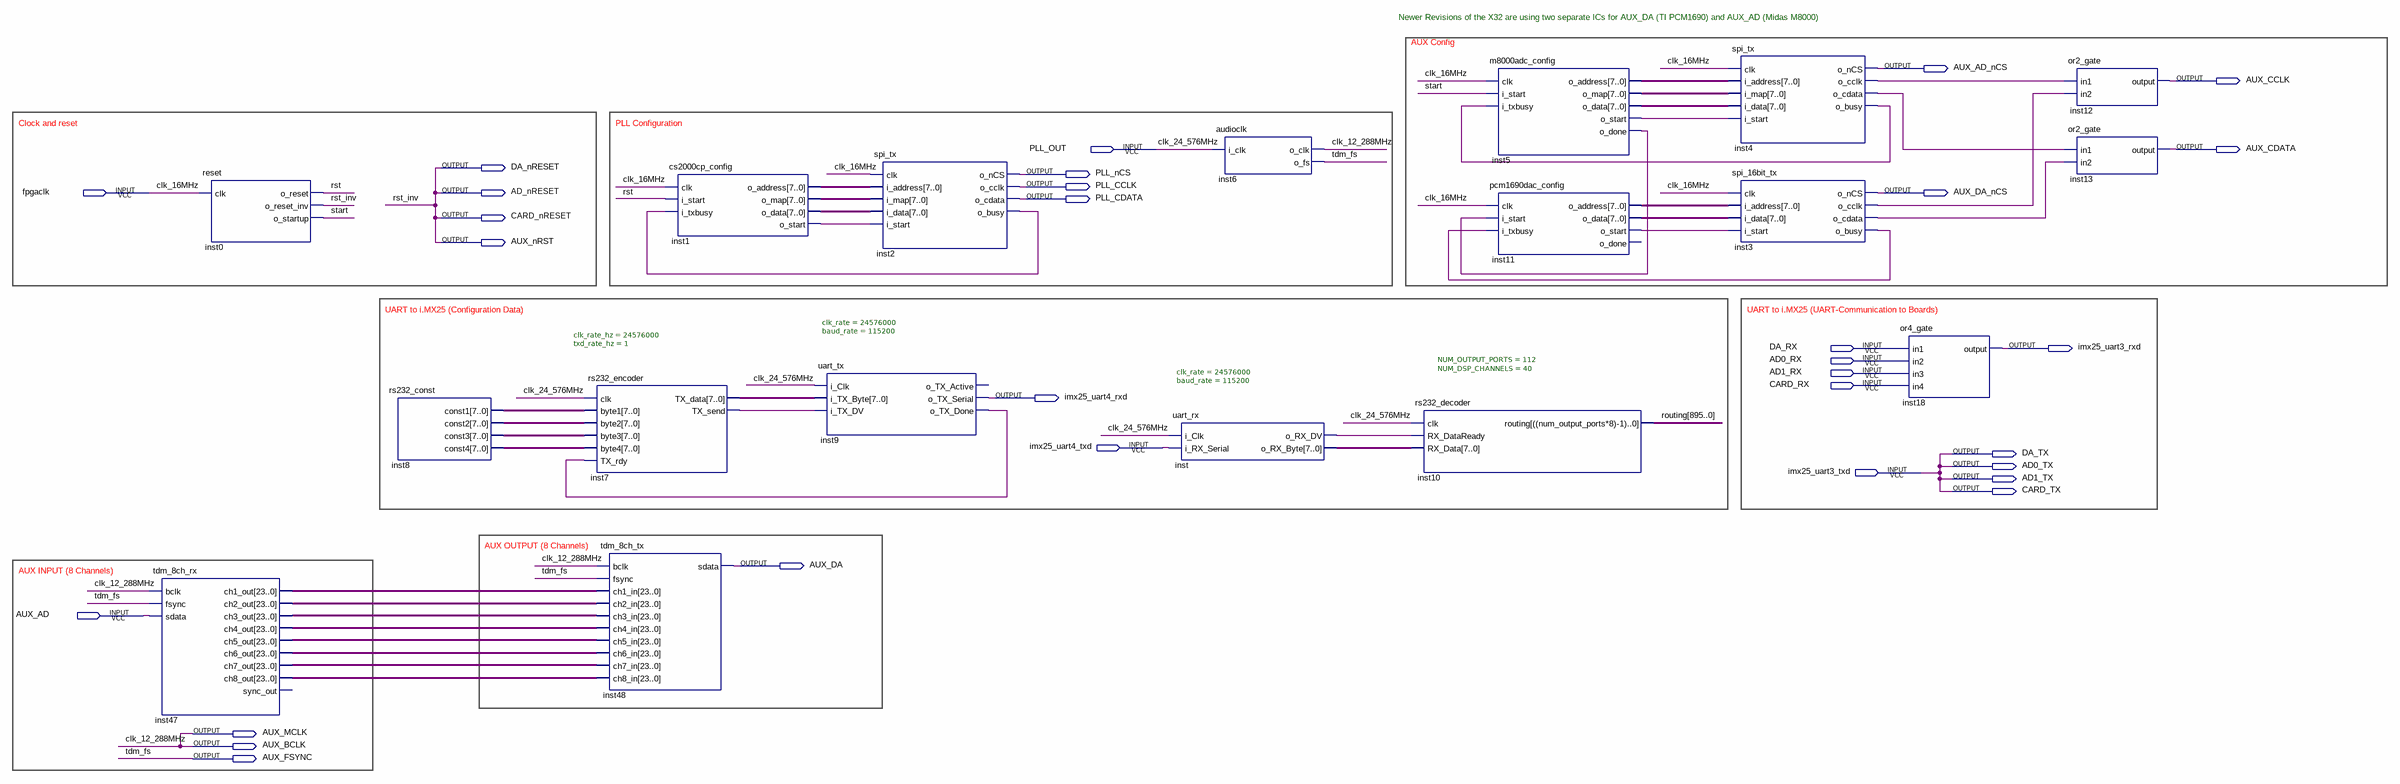
[diagram p0: schematic sheet]
// Quartus schematic main_minimaltest.bdf as structural Verilog: 18 symbols, 30 pins
module main_minimaltest (
  input  PLL_OUT,
  input  fpgaclk,
  input  DA_RX,
  input  AD0_RX,
  input  AD1_RX,
  input  CARD_RX,
  input  imx25_uart4_txd,
  input  imx25_uart3_txd,
  input  AUX_AD,
  output AUX_AD_nCS,
  output AUX_CCLK,
  output AUX_CDATA,
  output DA_nRESET,
  output PLL_nCS,
  output PLL_CCLK,
  output AD_nRESET,
  output AUX_DA_nCS,
  output PLL_CDATA,
  output CARD_nRESET,
  output AUX_nRST,
  output imx25_uart3_rxd,
  output imx25_uart4_rxd,
  output DA_TX,
  output AD0_TX,
  output AD1_TX,
  output CARD_TX,
  output AUX_DA,
  output AUX_MCLK,
  output AUX_BCLK,
  output AUX_FSYNC
);

  wire inst1_o_start, inst2_o_busy, inst3_o_busy, inst3_o_cclk, inst3_o_cdata, inst4_o_busy, inst4_o_cclk,
       inst4_o_cdata, inst5_o_done, inst5_o_start, inst7_tx_send, inst9_o_tx_done, inst11_o_start,
       inst_o_rx_dv, rst, start;
  wire [7:0] inst1_o_address, inst1_o_data, inst1_o_map, inst5_o_address, inst5_o_data, inst5_o_map,
       inst7_tx_data, inst8_const1, inst8_const2, inst8_const3, inst8_const4, inst11_o_address,
       inst11_o_data, inst_o_rx_byte;
  wire [23:0] inst47_ch1_out, inst47_ch2_out, inst47_ch3_out, inst47_ch4_out, inst47_ch5_out, inst47_ch6_out,
       inst47_ch7_out, inst47_ch8_out;
  wire [895:0] routing;

  tdm_8ch_rx inst47 (
    .bclk(AUX_BCLK), .fsync(AUX_FSYNC), .sdata(AUX_AD), .ch1_out(inst47_ch1_out), .ch2_out(inst47_ch2_out),
    .ch3_out(inst47_ch3_out), .ch4_out(inst47_ch4_out), .ch5_out(inst47_ch5_out), .ch6_out(inst47_ch6_out),
    .ch7_out(inst47_ch7_out), .ch8_out(inst47_ch8_out));  // open: sync_out
  reset inst0 (.clk(fpgaclk), .o_reset(rst), .o_reset_inv(AD_nRESET), .o_startup(start));
  rs232_const inst8 (.const1(inst8_const1), .const2(inst8_const2), .const3(inst8_const3), .const4(inst8_const4));
  rs232_encoder #(.clk_rate_hz(24576000), .txd_rate_hz(1)) inst7 (
    .clk(PLL_OUT), .byte1(inst8_const1), .byte2(inst8_const2), .byte3(inst8_const3), .byte4(inst8_const4),
    .TX_rdy(inst9_o_tx_done), .TX_data(inst7_tx_data), .TX_send(inst7_tx_send));
  tdm_8ch_tx inst48 (
    .bclk(AUX_BCLK), .fsync(AUX_FSYNC), .ch1_in(inst47_ch1_out), .ch2_in(inst47_ch2_out),
    .ch3_in(inst47_ch3_out), .ch4_in(inst47_ch4_out), .ch5_in(inst47_ch5_out), .ch6_in(inst47_ch6_out),
    .ch7_in(inst47_ch7_out), .ch8_in(inst47_ch8_out), .sdata(AUX_DA));
  cs2000cp_config inst1 (
    .clk(fpgaclk), .i_start(rst), .i_txbusy(inst2_o_busy), .o_address(inst1_o_address), .o_map(inst1_o_map),
    .o_data(inst1_o_data), .o_start(inst1_o_start));
  uart_tx #(.clk_rate(24576000), .baud_rate(115200)) inst9 (
    .i_Clk(PLL_OUT), .i_TX_Byte(inst7_tx_data), .i_TX_DV(inst7_tx_send), .o_TX_Serial(imx25_uart4_rxd),
    .o_TX_Done(inst9_o_tx_done));  // open: o_TX_Active
  spi_tx inst2 (
    .clk(fpgaclk), .i_address(inst1_o_address), .i_map(inst1_o_map), .i_data(inst1_o_data),
    .i_start(inst1_o_start), .o_nCS(PLL_nCS), .o_cclk(PLL_CCLK), .o_cdata(PLL_CDATA), .o_busy(inst2_o_busy));
  uart_rx #(.clk_rate(24576000), .baud_rate(115200)) inst (
    .i_Clk(PLL_OUT), .i_RX_Serial(imx25_uart4_txd), .o_RX_DV(inst_o_rx_dv), .o_RX_Byte(inst_o_rx_byte));
  audioclk inst6 (.i_clk(PLL_OUT), .o_clk(AUX_BCLK), .o_fs(AUX_FSYNC));
  rs232_decoder #(.NUM_OUTPUT_PORTS(112), .NUM_DSP_CHANNELS(40)) inst10 (
    .clk(PLL_OUT), .RX_DataReady(inst_o_rx_dv), .RX_Data(inst_o_rx_byte), .routing(routing));
  m8000adc_config inst5 (
    .clk(fpgaclk), .i_start(start), .i_txbusy(inst4_o_busy), .o_address(inst5_o_address),
    .o_map(inst5_o_map), .o_data(inst5_o_data), .o_start(inst5_o_start), .o_done(inst5_o_done));
  pcm1690dac_config inst11 (
    .clk(fpgaclk), .i_start(inst5_o_done), .i_txbusy(inst3_o_busy), .o_address(inst11_o_address),
    .o_data(inst11_o_data), .o_start(inst11_o_start));  // open: o_done
  spi_tx inst4 (
    .clk(fpgaclk), .i_address(inst5_o_address), .i_map(inst5_o_map), .i_data(inst5_o_data),
    .i_start(inst5_o_start), .o_nCS(AUX_AD_nCS), .o_cclk(inst4_o_cclk), .o_cdata(inst4_o_cdata),
    .o_busy(inst4_o_busy));
  spi_16bit_tx inst3 (
    .clk(fpgaclk), .i_address(inst11_o_address), .i_data(inst11_o_data), .i_start(inst11_o_start),
    .o_nCS(AUX_DA_nCS), .o_cclk(inst3_o_cclk), .o_cdata(inst3_o_cdata), .o_busy(inst3_o_busy));
  or4_gate inst18 (.in1(DA_RX), .in2(AD0_RX), .in3(AD1_RX), .in4(CARD_RX), .\output (imx25_uart3_rxd));
  or2_gate inst12 (.in1(inst4_o_cclk), .in2(inst3_o_cclk), .\output (AUX_CCLK));
  or2_gate inst13 (.in1(inst4_o_cdata), .in2(inst3_o_cdata), .\output (AUX_CDATA));

  assign AD0_TX = imx25_uart3_txd;
  assign AD1_TX = imx25_uart3_txd;
  assign AUX_MCLK = AUX_BCLK;
  assign AUX_nRST = AD_nRESET;
  assign CARD_nRESET = AD_nRESET;
  assign CARD_TX = imx25_uart3_txd;
  assign DA_nRESET = AD_nRESET;
  assign DA_TX = imx25_uart3_txd;

  // Other names for the same wires on the sheet: clk_12_288MHz = AUX_BCLK; rst_inv = AD_nRESET; clk_16MHz = fpgaclk;
  //   clk_24_576MHz = PLL_OUT; tdm_fs = AUX_FSYNC

  // Notes on the sheet:
  //   Newer Revisions of the X32 are using two separate ICs for AUX_DA (TI PCM1690) and AUX_AD (Midas M8000)
  //   AUX Config
  //   Clock and reset
  //   PLL Configuration
  //   UART to i.MX25 (Configuration Data)
  //   UART to i.MX25 (UART-Communication to Boards)
  //   AUX OUTPUT (8 Channels)
  //   AUX INPUT (8 Channels)
endmodule
